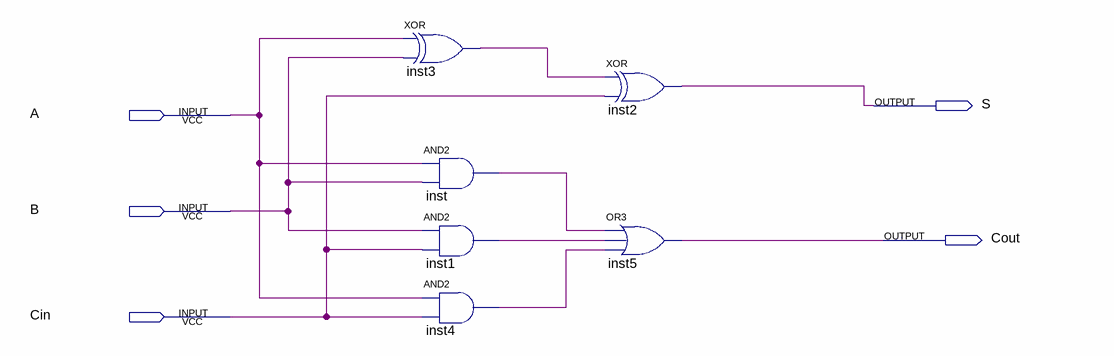
[diagram p0: schematic sheet]
// Quartus schematic somador.bdf as structural Verilog: 6 symbols, 5 pins
module somador (
  input  A,
  input  B,
  input  Cin,
  output S,
  output Cout
);

  wire inst1_out, inst3_out, inst4_out, inst_out;

  xor inst3 (inst3_out, A, B);
  and inst (inst_out, A, B);
  and inst1 (inst1_out, B, Cin);
  and inst4 (inst4_out, A, Cin);
  xor inst2 (S, inst3_out, Cin);
  or inst5 (Cout, inst_out, inst1_out, inst4_out);
endmodule
